# Altium schematic sheet tekprobe P2.SchDoc: TEKPROBE power supply
size 138 x 199 mm; SheetNumber: 2; SheetTotal: 2; _Revision_Date: R1 16.01.2021; _Page_Title: Linear regulators - Outputs; _First_Releash_Date: 16.01.2021; _Project_Number: 7.13.27.001.0521; _Project_Title: Tekprobe Power Supply; ProjectName: Stromnetz
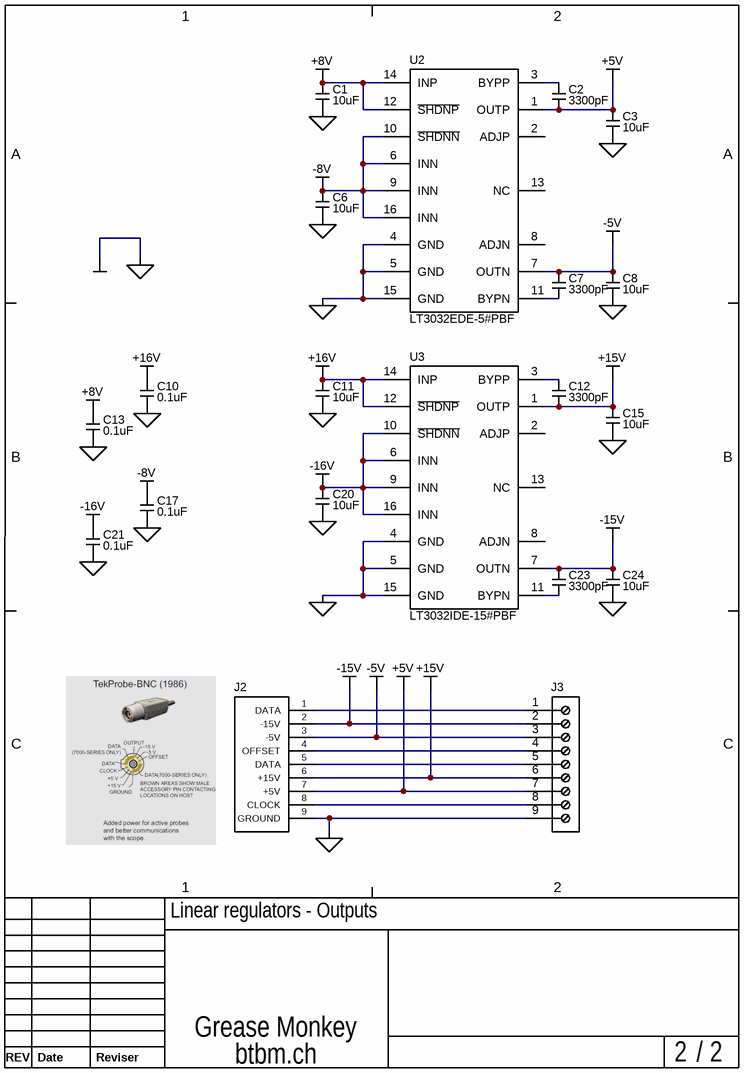
[diagram p0: tekprobe P2.SchDoc]

## Parts
C1  10uF  [CAP_0805]
C2  3300pF  [CAP_0805]
C3  10uF  [CAP_0805]
C6  10uF  [CAP_0805]
C7  3300pF  [CAP_0805]
C8  10uF  [CAP_0805]
C10  0.1uF  [CAP_0805]
C11  10uF  [CAP_0805]
C12  3300pF  [CAP_0805]
C13  0.1uF  [CAP_0805]
C15  10uF  [CAP_0805]
C17  0.1uF  [CAP_0805]
C20  10uF  [CAP_0805]
C21  0.1uF  [CAP_0805]
C23  3300pF  [CAP_0805]
C24  10uF  [CAP_0805]
J2  BNC JACK  [tekprobe]  (value not drawn)
J3  3.81 MM TERMINAL BLOCK  [691243310009]  (value not drawn)
U2  LT3032EDE-5#PBF  [LT3032]
U3  LT3032IDE-15#PBF  [LT3032]

## Nets
0V: C1.2 C3.2 C6.2 C8.2 C10.2 C11.2 C13.2 C15.2 C17.2 C20.2 C21.2 C24.2 J2.9(GROUND) J3.9 U2.4(GND) U2.5(GND) U2.15(GND) U3.4(GND) U3.5(GND) U3.15(GND)
+5V: C2.2 C3.1 J2.7(+5V) J3.7 U2.1(OUTP)
+8V: C1.1 C13.1 U2.12(~{SHDNP}) U2.14(INP)
+15V: C12.2 C15.1 J2.6(+15V) J3.6 U3.1(OUTP)
+16V: C10.1 C11.1 U3.12(~{SHDNP}) U3.14(INP)
-5V: C7.1 C8.1 J2.3(-5V) J3.3 U2.7(OUTN)
-8V: C6.1 C17.1 U2.6(INN) U2.9(INN) U2.10(~{SHDNN}) U2.16(INN)
-15V: C23.1 C24.1 J2.2(-15V) J3.2 U3.7(OUTN)
-16V: C20.1 C21.1 U3.6(INN) U3.9(INN) U3.10(~{SHDNN}) U3.16(INN)
NetC2_1: C2.1 U2.3(BYPP)
NetC7_2: C7.2 U2.11(BYPN)
NetC12_1: C12.1 U3.3(BYPP)
NetC23_2: C23.2 U3.11(BYPN)
NetJ2_1: J2.1(DATA) J3.1
NetJ2_4: J2.4(OFFSET) J3.4
NetJ2_5: J2.5(DATA) J3.5
NetJ2_8: J2.8(CLOCK) J3.8

Not connected (* = marked no-connect by the designer): U2 2(ADJP) 8(ADJN) 13(NC); U3 2(ADJP) 8(ADJN) 13(NC)

## Notes on the sheet
- 1
- 2
- A
- B
- C
- REV
- Date
- Reviser
- Grease Monkey
- btbm.ch
- /

## Library data of the parts
C1 C3 C6 C8 C11 C15 C20 C24 = CL21A106KAYNNNG: CAP CER 10UF 25V X5R 0805; Manufacturer: Samsung; Tolerance: 10%; Supplier 1: Digi-Key; Manufacturer Part Number: CL21A106KAYNNNG; RoHS: Yes; Category: Ceramic Capacitors; Stock 1: 221798; Pricing 1: 1=0.21000, 10=0.14600, 50=0.08280, 100=0.06870, 500=0.04816, 1000=0.03987 (USD); Mount: Surface Mount; Case/Package: 0805; Case Code (Metric): 2012; Case Code (Imperial): 0805; Min Operating Temperature: -55°C; Max Operating Temperature: 85°C; Capacitance: 10uF; Dielectric: X5R; Packaging: Tape and Reel; Package Quantity: 3000; Voltage Rating: 25V; Series: CL; Construction: Flat; Length: 2mm; Width: 0.049inch; Height: 1.25mm; Thickness: 0.057inch; Depth: 1.25mm; Radiation Hardening: No; Lead Free: Lead Free; RoHS Compliant: Yes; ComponentLink1URL: https://datasheet.ciiva.com/26920/getdatasheetpartid-660292-26920195.pdf?src-supplier=Verical; ComponentLink1Description: https://datasheet.ciiva.com/26920/getdatasheetpartid-660292-26920195.pdf?src-supplier=Verical; Supplier Part Number 1: 1276-6454-1-ND
C2 C7 C12 C23 = C0805C332K5RACTU: KEMET - C0805C332K5RACTU - SMD Multilayer Ceramic Capacitor, 3300 pF, 50 V, 0805 [2012 Metric], ± 10%, X7R, C Series KEMET; Capacitance: 3.3nF; Voltage Rating: 50V; Dissipation Factor: 2.5%; Supplier 1: Digi-Key; Manufacturer: KEMET; Manufacturer Part Number: C0805C332K5RACTU; RoHS: Yes; Category: Ceramic Capacitors; Stock 1: 33474; Pricing 1: 1=0.10000, 10=0.06700, 50=0.03660, 100=0.02990, 500=0.02134, 1000=0.01676 (USD); Mount: Surface Mount; Case/Package: 0805; Number of Pins: 2; Case Code (Metric): 2012; Case Code (Imperial): 0805; Contact Plating: Tin,Matte; Dielectric Material: Ceramic; Min Operating Temperature: -55°C; Max Operating Temperature: 125°C; Packaging: Tape and Reel; Tolerance: 10%; Package Quantity: 1; Voltage Rating (DC): 50V; Dielectric: X7R; Termination: SMD/SMT; Voltage: 50V; Series: C; Construction: Flat; Length: 2mm; Width: 0.049inch; Height: 0.78mm; Thickness: 0.035inch; Lead Pitch: 0.75mm; Depth: 1.25mm; Radiation Hardening: No; REACH SVHC: No SVHC; RoHS Compliant: Yes; ComponentLink1URL: https://datasheet.ciiva.com/7842/kem-c1002-x7r-smd-7842598.pdf?src-supplier=Element14; ComponentLink1Description: https://datasheet.ciiva.com/7842/kem-c1002-x7r-smd-7842598.pdf?src-supplier=Element14; ComponentLink2URL: https://datasheet.ciiva.com/26948/getdatasheetpartid-385720-26948486.pdf?src-supplier=Verical; ComponentLink2Description: https://datasheet.ciiva.com/26948/getdatasheetpartid-385720-26948486.pdf?src-supplier=Verical; ComponentLink3URL: https://datasheet.ciiva.com/5415/kem-c1002-x7r-smd-357932-5415032.pdf?src-supplier=Mouser; ComponentLink3Description: https://datasheet.ciiva.com/5415/kem-c1002-x7r-smd-357932-5415032.pdf?src-supplier=Mouser; ComponentLink4URL: https://datasheet.ciiva.com/6126/kem-c1002-x7r-smd-6126698.pdf?src-supplier=Farnell; ComponentLink4Description: https://datasheet.ciiva.com/6126/kem-c1002-x7r-smd-6126698.pdf?src-supplier=Farnell; ComponentLink5URL: https://datasheet.ciiva.com/7842/1851736-7842314.pdf?src-supplier=Element14; ComponentLink5Description: https://datasheet.ciiva.com/7842/1851736-7842314.pdf?src-supplier=Element14; ComponentLink6URL: https://datasheet.ciiva.com/7842/1851736-7842315.pdf?src-supplier=Element14; ComponentLink6Description: https://datasheet.ciiva.com/7842/1851736-7842315.pdf?src-supplier=Element14; Supplier Part Number 1: 399-1153-1-ND
C10 C13 C17 C21 = CL21B104MACNNNC: CAP CER 0.1UF 25V X7R 0805; Manufacturer: Samsung; Tolerance: 20%; Capacitance: 100nF; Supplier 1: Digi-Key; Manufacturer Part Number: CL21B104MACNNNC; RoHS: Yes; Category: Ceramic Capacitors; Stock 1: 134913; Pricing 1: 1=0.10000, 10=0.03200, 50=0.01720, 100=0.01410, 500=0.01006, 1000=0.00791 (USD); Mount: Surface Mount; Case/Package: 0805; Case Code (Metric): 2012; Case Code (Imperial): 0805; Min Operating Temperature: -55°C; Max Operating Temperature: 125°C; Dielectric: X7R; Packaging: Tape and Reel; Package Quantity: 1; Voltage Rating: 25V; Voltage Rating (DC): 25V; Series: CL; Construction: Flat; Length: 2mm; Width: 0.049inch; Height: 0.85mm; Depth: 1.25mm; Thickness: 0.037inch; Radiation Hardening: No; Lead Free: Lead Free; RoHS Compliant: Yes; ComponentLink1URL: https://datasheet.ciiva.com/26936/getdatasheetpartid-782453-26936905.pdf?src-supplier=Verical; ComponentLink1Description: https://datasheet.ciiva.com/26936/getdatasheetpartid-782453-26936905.pdf?src-supplier=Verical; Supplier Part Number 1: 1276-2449-1-ND
J2 = TEKPROBE: CONN BNC JACK STR 50 OHM SOLDER; Manufacturer: TE Connectivity; Manufacturer Part Number: 5-1634523-1; Body Material: Zinc; Plating: Nickel; Impedance: 50R; Frequency: 4GHz; Gender: Female; Connector Type: BNC,Jack; Polarity: Normal; Insulation Resistance: 5GR; Number of Positions: 1; PCB Mount Retention: Without; Sealable: No (Without); Dielectric Material: Polymethylpentene; Supplier 1: Digi-Key; RoHS: Yes; Category: RF / Coaxial Connectors; Pricing 1: 1=1.95000, 10=1.77400, 25=1.66520, 50=1.59260, 100=1.52030, 250=1.37552, 500=1.26692, 1000=1.08593 (USD); Mount: Panel; Contact Material: Bronze; Contact Plating: Gold; Body Plating: Nickel; Insulation Material: Polymethylpentene; Min Operating Temperature: -55°C; Max Operating Temperature: 85°C; Orientation: Straight; Package Quantity: 100; Fastening Type: Bayonet; Packaging: Bulk; Termination: Solder; Max Frequency: 4GHz; Length: 27.3mm; Depth: 13mm; Radiation Hardening: No; REACH SVHC: Unknown; ELV: Compliant; ComponentLink1URL: https://datasheet.ciiva.com/23783/1664198-23783552.pdf?src-supplier=Newark; ComponentLink1Description: https://datasheet.ciiva.com/23783/1664198-23783552.pdf?src-supplier=Newark; ComponentLink2URL: https://datasheet.ciiva.com/11762/0900766b80c71412-11762344.pdf?src-supplier=RSComponents; ComponentLink2Description: https://datasheet.ciiva.com/11762/0900766b80c71412-11762344.pdf?src-supplier=RSComponents; ComponentLink3URL: https://datasheet.ciiva.com/642/eng-cd-1634523-c-642763.pdf?src-supplier=Digi-Key; ComponentLink3Description: https://datasheet.ciiva.com/642/eng-cd-1634523-c-642763.pdf?src-supplier=Digi-Key; ComponentLink4URL: https://datasheet.ciiva.com/16652/eng-ds-6-1773448-5-zdc-rf-coax-50-75-ohm-1007-16652902.pdf?src-supplier=Avnet+Europe; ComponentLink4Description: https://datasheet.ciiva.com/16652/eng-ds-6-1773448-5-zdc-rf-coax-50-75-ohm-1007-16652902.pdf?src-supplier=Avnet+Europe; ComponentLink5URL: https://datasheet.ciiva.com/3131/eng-ds-6-1773448-5-zdc-rf-coax-50-75-ohm-1007-3131991.pdf?src-supplier=Avnet; ComponentLink5Description: https://datasheet.ciiva.com/3131/eng-ds-6-1773448-5-zdc-rf-coax-50-75-ohm-1007-3131991.pdf?src-supplier=Avnet; ComponentLink6URL: https://datasheet.ciiva.com/1448/580087-1448590.pdf?src-supplier=Element14; ComponentLink6Description: https://datasheet.ciiva.com/1448/580087-1448590.pdf?src-supplier=Element14; Supplier Part Number 1: A97548-ND; Stock 1: 14744
J3 = 691243310009: WR-TBL Serie 2433 Horizontal Entry Modular, Rising Cage Clamp, THT, pitch 3.81mm, 9p; Manufacturer: Wurth Elektronik; Modularity: No; PCB/Cable/Panel: PCB; Pin Number: 9; Rated Current [UL]: 10A; Working Voltage [UL]: 300VAC; ComponentLink1Description: Manufacturer; ComponentLink1URL: http://www.we-online.de; ComponentLink2URL: https://katalog.we-online.de/em/datasheet/691243310009.pdf; ComponentLink2Description: Datasheet; Mounting Technology: THT; Manufacturer Part Number: 691243310009; Packaging: Box; Operating Temperature: -30 to +120degC; Pitch: 3.81mm; Published Date: Feburary 2021; Type: Horizontal; Application: Rising Cage Clamp
U2 = LT3032EDE-5#PBF: IC REG LINEAR +-5V 14DFN; Manufacturer: Analog Devices / Linear Technology; Output Current: 150mA; Dropout Voltage: 300mV; Number of Outputs: 2; Output Voltage: 5V; Max Input Voltage: 20V; Min Input Voltage: 2.3V; Min Current Limit: 170mA; Polarity: Positive,Negative; Voltage - Output 2: -5V; Operating Supply Current: 25uA; Power Supply Rejection Ratio (PSRR): 68dB; Supplier 1: Digi-Key; Manufacturer Part Number: LT3032EDE-5#PBF; RoHS: Yes; Category: Voltage Regulators - Linear; Stock 1: 4272; Pricing 1: 1=5.87000, 10=5.27300, 25=4.98480, 100=4.32000, 250=4.09848, 500=3.67756, 1000=3.13500 (USD); Case/Package: DFN; Number of Pins: 14; Min Operating Temperature: -40°C; Max Operating Temperature: 125°C; Packaging: Rail/Tube; Package Quantity: 91; Number of Regulators: 2; Current - Output 1: 150mA; Current - Output 2: 150mA; Voltage - Output 1: 5V; Min Output Voltage: 5V; Max Output Voltage: 5V; Series: -; REACH SVHC: No SVHC; RoHS Compliant: Yes; ComponentLink1URL: https://datasheet.ciiva.com/8041/1679619-8041889.pdf?src-supplier=Element14; ComponentLink1Description: https://datasheet.ciiva.com/8041/1679619-8041889.pdf?src-supplier=Element14; ComponentLink2URL: https://datasheet.ciiva.com/2041/29070-2041604.pdf?src-supplier=Digi-Key; ComponentLink2Description: https://datasheet.ciiva.com/2041/29070-2041604.pdf?src-supplier=Digi-Key; Supplier Part Number 1: LT3032EDE-5#PBF-ND
U3 = LT3032IDE-15#PBF: IC REG LINEAR +-15V 14DFN; Manufacturer: Analog Devices / Linear Technology; Dropout Voltage: 300mV; Number of Outputs: 2; Output Voltage: 15V; Max Input Voltage: 20V; Min Input Voltage: 2.3V; Output Current: 150mA; Min Current Limit: 170mA; Operating Supply Current: 25uA; Power Supply Rejection Ratio (PSRR): 68dB; Supplier 1: Digi-Key; Manufacturer Part Number: LT3032IDE-15#PBF; RoHS: Yes; Category: Voltage Regulators - Linear; Stock 1: 249; Pricing 1: 1=6.80000, 10=6.10500, 25=5.77160, 100=5.00210, 250=4.74560, 500=4.25824, 1000=3.63000 (USD); Case/Package: DFN; Number of Pins: 14; Min Operating Temperature: -40°C; Max Operating Temperature: 125°C; Package Quantity: 91; Packaging: Rail/Tube; Number of Regulators: 2; Max Output Voltage: 15V; Min Output Voltage: 15V; Lead Free: Lead Free; RoHS Compliant: Yes; ComponentLink1URL: https://datasheet.ciiva.com/2059/29070-2059004.pdf?src-supplier=Digi-Key; ComponentLink1Description: https://datasheet.ciiva.com/2059/29070-2059004.pdf?src-supplier=Digi-Key; Supplier Part Number 1: 161-LT3032IDE-15#PBF-ND